# EAGLE design nrf5340 (EAGLE 9.7.0)
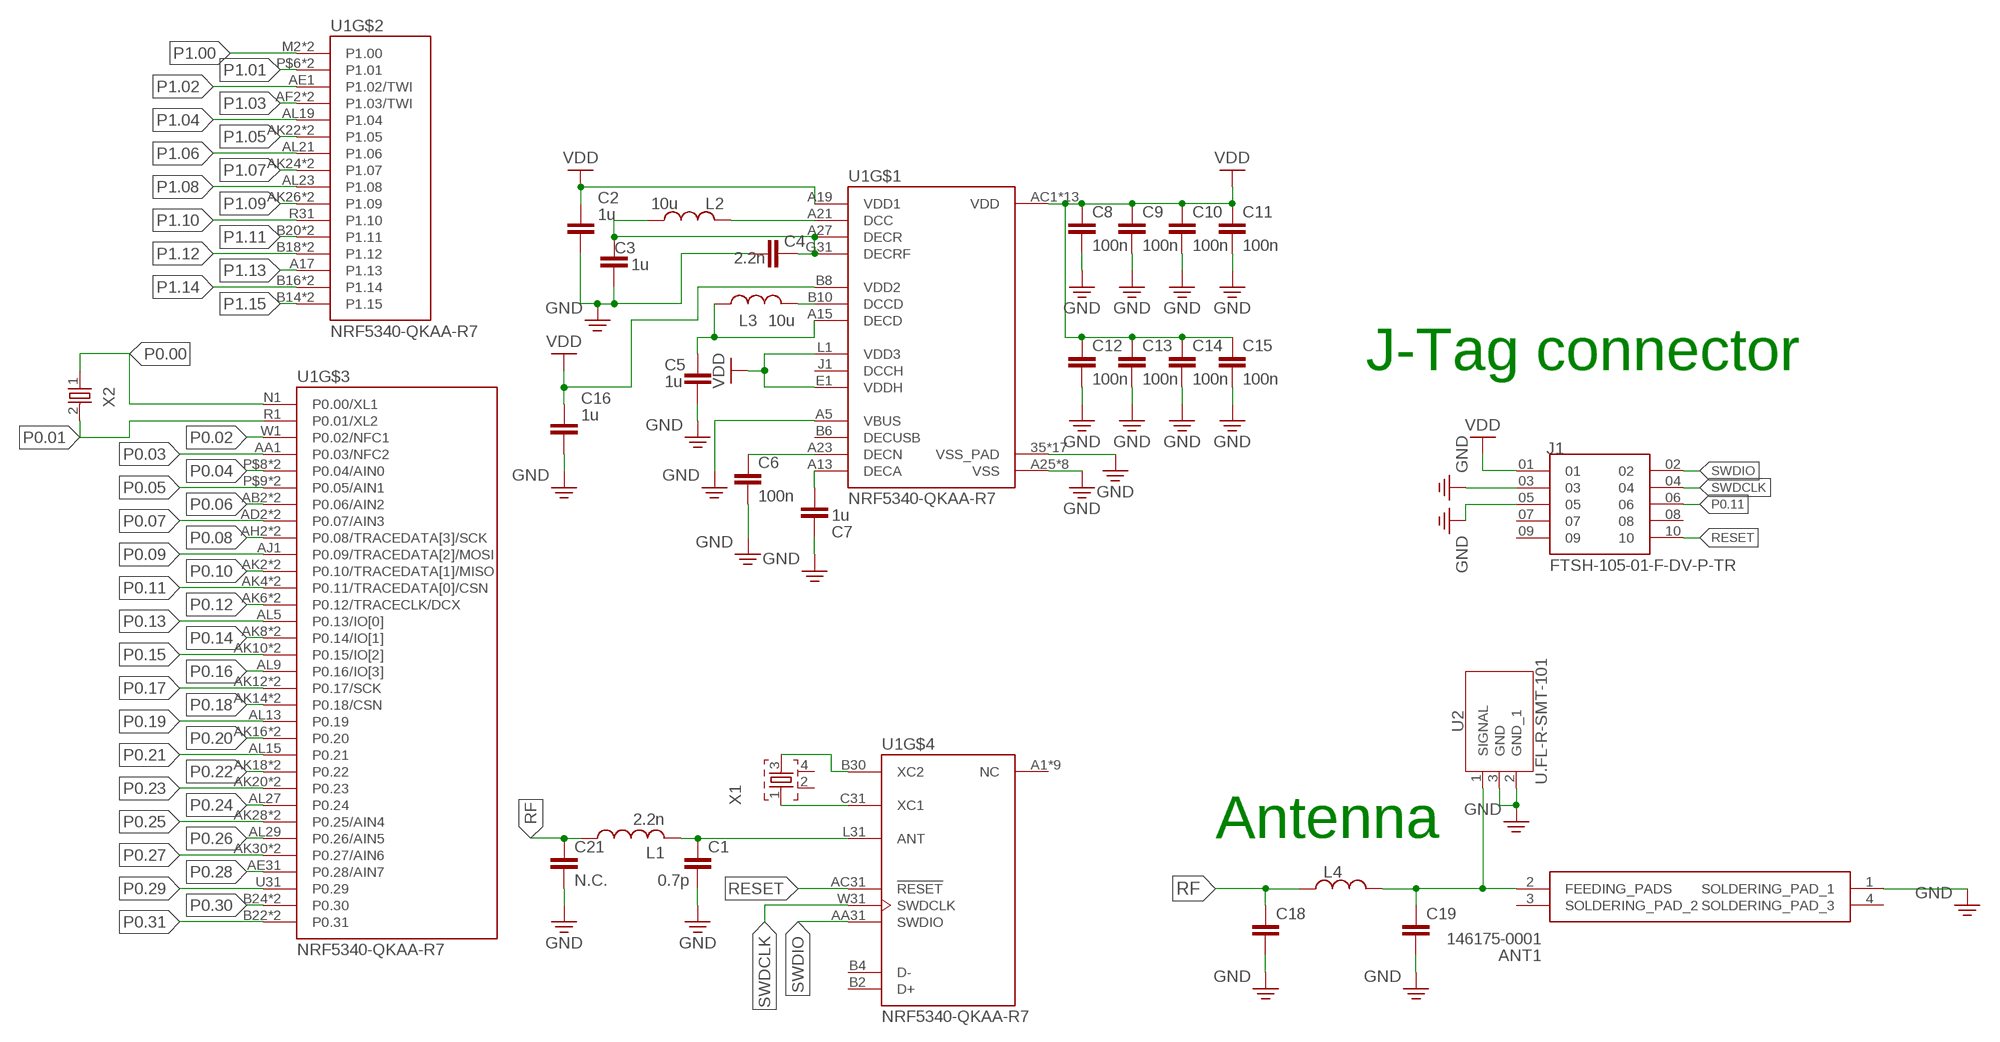
[diagram p0: schematic, sheet 1]

## Parts
ANT1  146175-0001  [1461750001]
C1  0.7p  CAPACITOR_0201_N  [RESC0201_N]
C2  1u  C_CHIP-0402(1005-METRIC)  [CAPC1005X60]
C3  1u  C_CHIP-0402(1005-METRIC)  [CAPC1005X60]
C4  2.2n  CAPACITOR_0201_N  [RESC0201_N]
C5  1u  C_CHIP-0402(1005-METRIC)  [CAPC1005X60]
C6  100n  CAPACITOR_0201_N  [RESC0201_N]
C7  1u  C_CHIP-0402(1005-METRIC)  [CAPC1005X60]
C8  100n  CAPACITOR_0201_N  [RESC0201_N]
C9  100n  CAPACITOR_0201_N  [RESC0201_N]
C10  100n  CAPACITOR_0201_N  [RESC0201_N]
C11  100n  CAPACITOR_0201_N  [RESC0201_N]
C12  100n  CAPACITOR_0201_N  [RESC0201_N]
C13  100n  CAPACITOR_0201_N  [RESC0201_N]
C14  100n  CAPACITOR_0201_N  [RESC0201_N]
C15  100n  CAPACITOR_0201_N  [RESC0201_N]
C16  1u  C_CHIP-0402(1005-METRIC)  [CAPC1005X60]
C18  CAPACITOR_0201_L  [RESC0201_L]
C19  CAPACITOR_0201_L  [RESC0201_L]
C21  N.C.  CAPACITOR_0201_N  [RESC0201_N]
J1  FTSH-105-01-F-DV-P-TR  [SAMTEC_FTSH-105-01-F-DV-P-TR]
L1  2.2n  INDUCTOR_0201_N  [RESC0201_N]
L2  10u  L_CHIP-0603(1608-METRIC)  [INDC1608X95N]
L3  10u  L_CHIP-0603(1608-METRIC)  [INDC1608X95N]
L4  L_CHIP-0402(1006-METRIC)  [INDC1006X60N]
U1  NRF5340-QKAA-R7  [XCVR_NRF5340-QKAA-R7]
U2  U.FL-R-SMT-101  [U.FL-R-SMT-1(XX)]
X1  XTAL_32MHZ  [BT-XTAL_2016_N]
X2  XTAL_32KHZ  [XTAL_3215_N]

## Nets
GND: ANT1.1(SOLDERING_PAD_1) C1.2 C2.2 C3.2 C4.2 C5.2 C6.2 C7.2 C8.2 C9.2 C10.2 C11.2 C12.2 C13.2 C14.2 C15.2 C16.2 C18.2 C19.2 C21.2 J1.03 J1.05 U1.35(VSS_PAD) U1.36(VSS_PAD) U1.37(VSS_PAD) U1.38(VSS_PAD) U1.39(VSS_PAD) U1.40(VSS_PAD) U1.41(VSS_PAD) U1.43(VSS_PAD) U1.44(VSS_PAD) U1.45(VSS_PAD) U1.46(VSS_PAD) U1.47(VSS_PAD) U1.48(VSS_PAD) U1.49(VSS_PAD) U1.50(VSS_PAD) U1.51(VSS_PAD) U1.104(VSS_PAD) U1.A5(VBUS) U1.A25(VSS) U1.B12(VSS) U1.B26(VSS) U1.G1(VSS) U1.H2(VSS) U1.J31(VSS) U1.P$3(VSS) U1.P$35(VSS) U2.2(GND_1) U2.3(GND)
N$1: C1.1 L1.2 U1.L31(ANT)
N$2: U1.C31(XC1) X1.1
N$3: U1.B30(XC2) X1.3
N$4: C6.1 U1.A23(DECN)
N$5: L2.2 U1.A21(DCC)
N$6: L3.2 U1.B10(DCCD)
N$7: C5.1 L3.1 U1.A15(DECD)
N$8: C3.1 C4.1 L2.1 U1.A27(DECR) U1.G31(DECRF)
N$9: C7.1 U1.A13(DECA)
N$11: ANT1.2(FEEDING_PADS) C19.1 L4.2 U2.1(SIGNAL)
P0.00: U1.N1(P0.00/XL1) X2.1
P0.01: U1.R1(P0.01/XL2) X2.2
P0.02: U1.W1(P0.02/NFC1)
P0.03: U1.AA1(P0.03/NFC2)
P0.04: U1.P$8(P0.04/AIN0) U1.V2(P0.04/AIN0)
P0.05: U1.P$9(P0.05/AIN1) U1.Y2(P0.05/AIN1)
P0.06: U1.AB2(P0.06/AIN2) U1.P$10(P0.06/AIN2)
P0.07: U1.AD2(P0.07/AIN3) U1.P$11(P0.07/AIN3)
P0.08: U1.AH2(P0.08/TRACEDATA[3]/SCK) U1.P$13(P0.08/TRACEDATA[3]/SCK)
P0.09: U1.AJ1(P0.09/TRACEDATA[2]/MOSI)
P0.10: U1.AK2(P0.10/TRACEDATA[1]/MISO) U1.P$14(P0.10/TRACEDATA[1]/MISO)
P0.11: J1.06 U1.AK4(P0.11/TRACEDATA[0]/CSN) U1.P$15(P0.11/TRACEDATA[0]/CSN)
P0.12: U1.AK6(P0.12/TRACECLK/DCX) U1.P$16(P0.12/TRACECLK/DCX)
P0.13: U1.AL5(P0.13/IO[0])
P0.14: U1.AK8(P0.14/IO[1]) U1.P$17(P0.14/IO[1])
P0.15: U1.AK10(P0.15/IO[2]) U1.P$18(P0.15/IO[2])
P0.16: U1.AL9(P0.16/IO[3])
P0.17: U1.AK12(P0.17/SCK) U1.P$19(P0.17/SCK)
P0.18: U1.AK14(P0.18/CSN) U1.P$20(P0.18/CSN)
P0.19: U1.AL13(P0.19)
P0.20: U1.AK16(P0.20) U1.P$21(P0.20)
P0.21: U1.AL15(P0.21)
P0.22: U1.AK18(P0.22) U1.P$22(P0.22)
P0.23: U1.AK20(P0.23) U1.P$23(P0.23)
P0.24: U1.AL27(P0.24)
P0.25: U1.AK28(P0.25/AIN4) U1.P$27(P0.25/AIN4)
P0.26: U1.AL29(P0.26/AIN5)
P0.27: U1.AK30(P0.27/AIN6) U1.P$28(P0.27/AIN6)
P0.28: U1.AE31(P0.28/AIN7)
P0.29: U1.U31(P0.29)
P0.30: U1.B24(P0.30) U1.P$34(P0.30)
P0.31: U1.B22(P0.31) U1.P$33(P0.31)
P1.00: U1.M2(P1.00) U1.P$5(P1.00)
P1.01: U1.P2(P1.01) U1.P$6(P1.01)
P1.02: U1.AE1(P1.02/TWI)
P1.03: U1.AF2(P1.03/TWI) U1.P$12(P1.03/TWI)
P1.04: U1.AL19(P1.04)
P1.05: U1.AK22(P1.05) U1.P$24(P1.05)
P1.06: U1.AL21(P1.06)
P1.07: U1.AK24(P1.07) U1.P$25(P1.07)
P1.08: U1.AL23(P1.08)
P1.09: U1.AK26(P1.09) U1.P$26(P1.09)
P1.10: U1.R31(P1.10)
P1.11: U1.B20(P1.11) U1.P$32(P1.11)
P1.12: U1.B18(P1.12) U1.P$31(P1.12)
P1.13: U1.A17(P1.13)
P1.14: U1.B16(P1.14) U1.P$30(P1.14)
P1.15: U1.B14(P1.15) U1.P$29(P1.15)
RESET: J1.10 U1.AC31(!RESET)
RF: C18.1 C21.1 L1.1 L4.1
SWDCLK: J1.04 U1.W31(SWDCLK)
SWDIO: J1.02 U1.AA31(SWDIO)
VDD: C2.1 C8.1 C9.1 C10.1 C11.1 C12.1 C13.1 C14.1 C15.1 C16.1 J1.01 U1.A19(VDD1) U1.AC1(VDD) U1.AG1(VDD) U1.AJ31(VDD) U1.AL3(VDD) U1.AL7(VDD) U1.AL11(VDD) U1.AL17(VDD) U1.AL25(VDD) U1.B8(VDD2) U1.B28(VDD) U1.C1(VDD) U1.E1(VDDH) U1.E31(VDD) U1.L1(VDD3) U1.N31(VDD) U1.U1(VDD)
Unconnected: ANT1.3(SOLDERING_PAD_2) ANT1.4(SOLDERING_PAD_3) J1.07 J1.08 J1.09 U1.A1(NC) U1.A31(NC) U1.AG31(NC) U1.AL1(NC) U1.AL31(NC) U1.B2(D+) U1.B4(D-) U1.D2(NC) U1.F2(NC) U1.K2(NC) U1.T2(NC) X1.2 X1.4

## Notes on the sheet
- J-Tag connector
- Antenna

## Power pins joined to a net without a drawn wire
DCCH: U1.J1(DCCH)
DECUSB: U1.B6(DECUSB)

## Library data of the parts
ANT1 = ChronosV5 v10:146175-0001: Antennas 2.4/5GHz SMTOnGround MID Chip Antenna Source: Datasheet <https://www.molex.com/pdm_docs/sd/1461750001_sd.pdf>; DESCRIPTION: Antennas 2.4/5GHz SMTOnGround MID Chip Antenna; HEIGHT: 4.1mm; MANUFACTURER_NAME: Molex; MANUFACTURER_PART_NUMBER: 146175-0001; MOUSER_PART_NUMBER: 538-146175-0001; MOUSER_PRICE-STOCK: https://www.mouser.co.uk/ProductDetail/Molex/146175-0001?qs=XFe3dyCRgQjkov2fyUw2sg%3D%3D
C1 C4 C6 C8-C15 C18 C19 C21 = ChronosV5 v10:CAPACITOR: Generic chip capacitor
C2 C3 C5 C7 C16 = ChronosV5 v10:C: Capacitor - Generic; CATEGORY: Capacitor
J1 = FTSH-105-01-F-DV-P-TR:FTSH-105-01-F-DV-P-TR; MANUFACTURER: Samtec; PARTREV: R; STANDARD: Manufacturer Recommendations
L1 = ChronosV5 v10:INDUCTOR: Generic chip inductor
L2-L4 = Inductor:L: Inductor Fixed - Generic; CATEGORY: Inductor; SUB-CATEGORY: Fixed
U1 = NRF5340-aQFN:NRF5340-QKAA-R7; MANUFACTURER: Nordic Semiconductor; MAXIMUM_PACKAGE_HEIGHT: 0.85mm; PARTREV: 1.0; STANDARD: Manufacturer Recommendations
U2 = ChronosV5 v10:U.FL-R-SMT-1: U.FL (UMCC) Connector Receptacle, Male Pin 50Ohm Surface Mount Solder Datasheet <https://media.digikey.com/pdf/Data%20Sheets/Hirose%20PDFs/UFL%20Series.pdf> Drawing <https://www.hirose.com/product/document?clcode=CL0331-0472-2-10&productname=U.FL-R-SMT-1(10)&series=U.FL&documenttype=2DDrawing&lang=en&documentid=0000940684>; CATEGORY: RF Connectors / Coaxial Connectors; DESCRIPTION: Ultra Small Surface Mount Coaxial Connectors; MANUFACTURER: Hirose Electric Co Ltd; MPN: U.FL-R-SMT-1(01); OPERATING_TEMPERATURE: -40˚C to +90˚C; PART_STATUS: Active; PITCH: -; ROHS_COMPLIANCE: RoHS Compliant; SERIES: U.FL; SUBCATEGORY: RF Interconnects; TYPE: Receptacle, Male Pin,Surface Mount
X1 = Nordic_nRF:XTAL_32MHZ
X2 = Nordic_nRF:XTAL_32KHZ

## Board
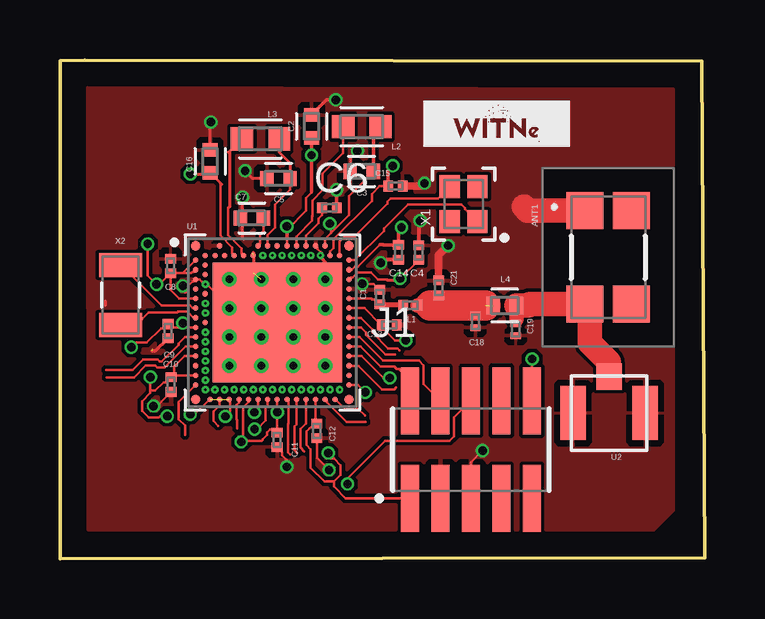
[diagram p1: board, top side]
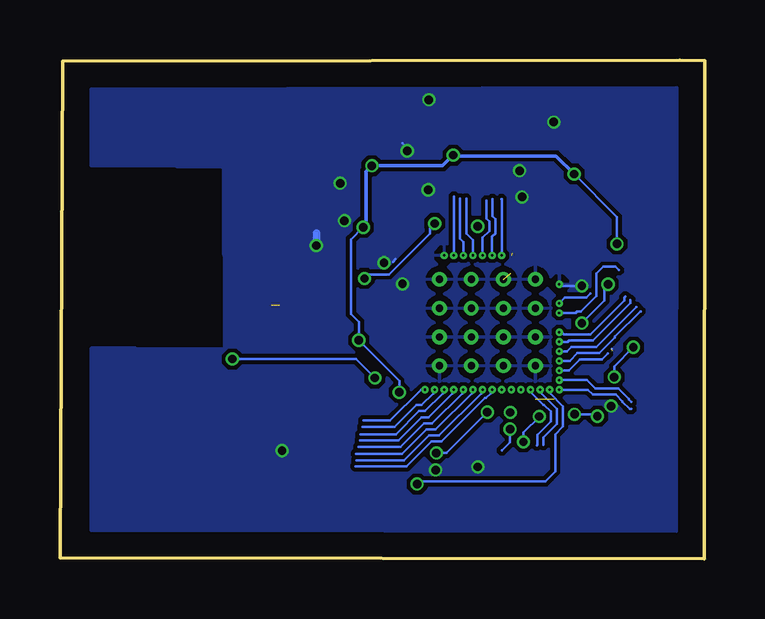
[diagram p2: board, bottom side, seen from below]

Size 26.88 x 20.81 mm. Coordinates in mm from the lower left corner, seen from the top.
Outline: 1.04,20.81 26.76,20.75 26.88,0.04 0.02,0 0,20.78 1.04,20.81
Copper layers (1*16): Top / Bottom
Stack-up 2 Layer Stack: Top SilkScreen Epoxy Ink / Top SolderMask SR:Green 0.0254mm Dk 4.3 / Top Surface Finish Lead-Free 0.02mm / Top CuFoil:007 0.035mm / Dielectric-1 Core:084 1.067mm / Bottom CuFoil:007 0.035mm / Bottom Surface Finish Lead-Free 0.02mm / Bottom SolderMask SR:Green 0.0254mm Dk 4.3 / Bottom SilkScreen Epoxy Ink
Design rules: minimum copper width 0.005mm, minimum drill size 0.35mm, copper clearance wire_polygon to wire_polygon 6mil, copper clearance wire_polygon to pad_smd 6mil, copper clearance wire_polygon to via 6mil, copper clearance pad_smd to pad_smd 6mil, copper clearance pad_smd to via 6mil, copper clearance via to via 6mil, copper clearance smd to pad (same net) 6mil, copper clearance smd to via (same net) 6mil, copper clearance smd to smd (same net) 6mil, dimension clearance 40mil, via restrict clearance 0mil, restrict clearance 0mil, drill distance 6mil, keepout clearance 0mil
RestrictTop: area 20.1,12.5 to 23.7,16.3; area 22,12.6 to 25.6,16.4; area 20.2,8.9 to 23.8,12.7; area 22,8.8 to 25.6,12.6
RestrictBottom: area 22.1,12.5 to 25.7,16.3; area 20.1,12.5 to 23.7,16.3; area 22,8.9 to 25.6,12.7; area 20.1,8.8 to 23.7,12.6

### Footprints (pad centres in the part's own frame; a part is rotated, then mirrored left to right if it is on the bottom)
1461750001 = smd 1.54 x 1.54: 1 -1.95,-0.97; 2 1.95,-0.97; 3 1.95,0.97; 4 -1.95,0.97
RESC0201_N = smd 0.4 x 0.45: 1 -0.305,0; 2 0.305,0
CAPC1005X60 = smd 0.56 x 0.629: 1 -0.485,0; 2 0.485,0
RESC0201_L = smd 0.28 x 0.43: 1 -0.255,0; 2 0.255,0
SAMTEC_FTSH-105-01-F-DV-P-TR = smd 0.74 x 2.79: 01 -2.54,-2.035; 02 -2.54,2.035; 03 -1.27,-2.035; 04 -1.27,2.035; 05 0,-2.035; 06 0,2.035; 07 1.27,-2.035; 08 1.27,2.035; 09 2.54,-2.035; 10 2.54,2.035
INDC1608X95N = smd 0.9 x 0.97: 1 -0.785,0 | smd 0.933 x 0.97: 2 0.769,0
INDC1006X60N = smd 0.56 x 0.729: 1 -0.485,0; 2 0.485,0
XCVR_NRF5340-QKAA-R7 = drill 0.305 pad 0.61: 35 -1.8,-1.8; 36 -0.467,-1.8; 37 0.867,-1.8; 38 2.2,-1.8; 39 -1.8,-0.6; 40 -0.467,-0.6; 41 0.867,-0.6; 43 2.2,-0.6; 44 -1.8,0.6; 45 -0.467,0.6; 46 0.867,0.6; 47 2.2,0.6; 48 -1.8,1.8; 49 -0.467,1.8; 50 0.867,1.8; 51 2.2,1.8 | smd 5.4 x 5: 104 0.2,0 | smd 0.4 x 0.4: A1 -3.2,3.2; A31 3.2,3.2; AL1 -3.2,-3.2; AL31 3.2,-3.2 | smd 0.225 x 0.225: A5 -2.2,3.2; A13 -0.6,3.2; A15 -0.2,3.2; A17 0.2,3.2; A19 0.6,3.2; A21 1,3.2; A23 1.4,3.2; A25 1.8,3.2; A27 2.2,3.2; AA1 -3.2,-1; AA31 3.2,-1; AB2 -2.8,-1.2; AC1 -3.2,-1.4; AC31 3.2,-1.4; AD2 -2.8,-1.6; AE1 -3.2,-1.8; AE31 3.2,-1.8; AF2 -2.8,-2; AG1 -3.2,-2.2; AG31 3.2,-2.2; AH2 -2.8,-2.4; AJ1 -3.2,-2.6; AJ31 3.2,-2.6; AK2 -2.8,-2.8; AK4 -2.4,-2.8; AK6 -2,-2.8; AK8 -1.6,-2.8; AK10 -1.2,-2.8; AK12 -0.8,-2.8; AK14 -0.4,-2.8; AK16 0,-2.8; AK18 0.4,-2.8; AK20 0.8,-2.8; AK22 1.2,-2.8; AK24 1.6,-2.8; AK26 2,-2.8; AK28 2.4,-2.8; AK30 2.8,-2.8; AL3 -2.6,-3.2; AL5 -2.2,-3.2; AL7 -1.8,-3.2; AL9 -1.4,-3.2; AL11 -1,-3.2; AL13 -0.6,-3.2; AL15 -0.2,-3.2; AL17 0.2,-3.2; AL19 0.6,-3.2; AL21 1,-3.2; AL23 1.4,-3.2; AL25 1.8,-3.2; AL27 2.2,-3.2; AL29 2.6,-3.2; B2 -2.8,2.8; B4 -2.4,2.8; B6 -2,2.8; B8 -1.6,2.8; B10 -1.2,2.8; B12 -0.8,2.8; B14 -0.4,2.8; B16 0,2.8; B18 0.4,2.8; B20 0.8,2.8; B22 1.2,2.8; B24 1.6,2.8; B26 2,2.8; B28 2.4,2.8; B30 2.8,2.8; C1 -3.2,2.6; C31 3.2,2.6; D2 -2.8,2.4; E1 -3.2,2.2; E31 3.2,2.2; F2 -2.8,2; G1 -3.2,1.8; G31 3.2,1.8; H2 -2.8,1.6; J1 -3.2,1.4; J31 3.2,1.4; K2 -2.8,1.2; L1 -3.2,1; L31 3.2,1; M2 -2.8,0.8; N1 -3.2,0.6; N31 3.2,0.6; P2 -2.8,0.4; R1 -3.2,0.2; R31 3.2,0.2; T2 -2.8,0; U1 -3.2,-0.2; U31 3.2,-0.2; V2 -2.8,-0.4; W1 -3.2,-0.6; W31 3.2,-0.6; Y2 -2.8,-0.8 | drill 0.1 pad 0.23: P$3 -2.8,1.6; P$5 -2.8,0.8; P$6 -2.8,0.4; P$8 -2.8,-0.4; P$9 -2.8,-0.8; P$10 -2.8,-1.2; P$11 -2.8,-1.6; P$12 -2.8,-2; P$13 -2.8,-2.4; P$14 -2.8,-2.8; P$15 -2.4,-2.8; P$16 -2,-2.8; P$17 -1.6,-2.8; P$18 -1.2,-2.8; P$19 -0.8,-2.8; P$20 -0.4,-2.8; P$21 0,-2.8; P$22 0.4,-2.8; P$23 0.8,-2.8; P$24 1.2,-2.8; P$25 1.6,-2.8; P$26 2,-2.8; P$27 2.4,-2.8; P$28 2.8,-2.8; P$29 -0.4,2.8; P$30 0,2.8; P$31 0.4,2.8; P$32 0.8,2.8; P$33 1.2,2.8; P$34 1.6,2.8; P$35 2,2.8
U.FL-R-SMT-1(XX) = smd 1.05 x 1.1: 1 0,1.525 | smd 1.05 x 2.25: 2 -1.5,0; 3 1.5,0
BT-XTAL_2016_N = smd 0.95 x 0.85: 1 -0.725,-0.575; 2 0.725,-0.575; 3 0.725,0.575; 4 -0.725,0.575
XTAL_3215_N = smd 1 x 1.8: 1 -1.25,0; 2 1.25,0

### Placement (x,y rotation side)
ANT1  22.86,12.58 270 top
C1  13.33,10.92 90 top
C2  10.49,18.04 90 top
C3  12.58,16.16 180 top
C4  14.96,12.78 90 top
C5  9.11,15.87 180 top
C6  11.23,14.64 0 top
C7  8,14.22 180 top
C8  4.61,12.22 90 top
C9  4.51,9.51 270 top
C10  4.63,7.27 270 top
C11  9.05,4.97 270 top
C12  10.71,5.34 270 top
C13  13.73,9.76 0 top
C14  14.12,12.79 270 top
C15  13.99,15.55 0 top
C16  6.26,16.58 90 top
C18  17.32,9.9 270 top
C19  19,9.57 270 top
C21  15.79,11.31 90 top
J1  17.13,4.56 0 top
L1  14.61,10.58 180 top
L2  12.58,18.03 180 top
L3  8.36,17.52 180 top
L4  18.54,10.57 0 top
U1  8.86,9.86 0 top
U2  22.89,6.08 0 top
X1  16.83,14.8 90 top
X2  2.53,11.01 270 top

### Tracks (layer width: path | path; a pad name or v marks a point on that pad's centre or on a via)
GND  (via drill 0.35, 0.35 pad 0.5)  (3 unrouted)
  Top 0.076: 8.07,12.73 8.09,12.7
  Top 0.102: 13.33,12.18 13.33,12.19 13.37,12.22 v13.37,12.35 | v12.4,17.01 12.11,16.72 12.11,16.17 C3.2 | 8.16,12.27 8.16,12 8.08,11.92 | U1.104 7.71,9.86 6.19,11.38 6.14,11.38 U1.P$3 5.98,11.54 5.93,11.54 5.81,11.66 U1.G1 5.58,11.58 5.53,11.58 5.21,11.26 5.21,11.14 | U1.A25 10.74,12.98 10.74,12.93 10.92,12.76 10.92,12.6 | C1.2 13.08,11.47 v12.6,11.47 | C10.2 4.04,6.38 v3.9,6.38 | J1.05 17.13,4.03 v17.62,4.52 | C12.2 10.71,4.22 v11.22,3.71 | v9.46,3.84 9.46,4.14 9.27,4.33 9.27,4.45 C11.2
  Top 0.127: C6.2 v11.54,15.38 v11.53,15.39 | C5.2 8.04,15.87 v7.72,16.19 | C16.2 6.26,18.19 v6.29,18.22 | 8.03,12.76 8.07,12.73 | 7.66,13.33 7.61,13.37 v7.61,15.1 | 8.06,12.8 8.08,12.77 8.08,12.71 8.09,12.7 8.09,12.34 8.16,12.27
  Top 0.15: C4.2 14.96,14.05 v15.02,14.11
  Top 0.152: C2.2 11.11,19.15 v11.5,19.15 | C14.2 13.63,12.48 13.33,12.19 | 5.22,11.14 5.21,11.14 5.12,11.23 v5.12,11.39 | C9.2 3.97,8.67 3.85,8.67 | U1.P$35 10.92,12.6 10.92,12.52 11.06,12.38 U1.51 | 1.88,10.6 1.88,10.73
  Top 0.305: C21.2 15.79,12.67 v16.19,13.07 | C15.2 15.08,15.55 v15.2,15.67
  Top 1.016: ANT1.1 19.5,14.53 19.34,14.69
  Bottom 0.102: v12.4,17.01 12.4,17.14 12.6,17.34 | U1.P$3 5.99,11.39 v5.12,11.39 | 3.86,8.75 | 13,12.38 12.88,12.51 | 12.53,11.53 12.59,11.47 v12.6,11.47 | v9.46,3.84
  Bottom 0.305: 16.19,13.6 v16.19,13.07
  pour Top: -2.85,21.26 -2.85,1.15 24.78,1.15 25.64,2.01 25.64,20.85 25.23,21.26
  pour Bottom: -3.11,21.35 25.65,21.35 25.65,0.07 -3.11,0.07
N$1
  Top 0.102: U1.L31 12.98,10.86 13.02,10.82 13.13,10.82 C1.1
  Top 0.127: C1.1
  Top 0.15: 13.24,10.7 C1.1
  Top 0.203: C1.1 14.27,10.62 L1.2
N$2
  Top 0.102: X1.1 16.88,14.6 16.88,14.63 16.74,14.78 14.51,14.78 13.51,13.78 13.51,13.68 12.29,12.46 U1.C31
N$3
  Top 0.102: X1.3 15.76,15.03 13.79,15.03 13.67,14.91 13.67,14.82 12.31,13.46 11.89,13.46 11.66,13.23 11.66,12.89 U1.B30
N$4
  Top 0.102: U1.A23 10.26,13.48 10.77,14 10.77,14.19 10.92,14.34 C6.1
  Top 0.127: 10.92,14.51 C6.1
N$5
  Top 0.102: L2.2 11.81,16.93 10.95,16.06 10.95,15.38 10.52,14.95 10.52,14.29 10.52,14.1 9.86,13.45 U1.A21
N$6
  Top 0.102: U1.B10 7.58,12.74 7.58,12.95 7.02,13.51 7.02,14.62
  Top 0.127: 7.02,16.95 7.09,17.01 | 7.09,17.01 L3.2 | 7.02,14.62 7.09,14.69 7.09,17.01
N$7
  Top 0.102: U1.A15 8.66,13.51 8.97,13.82 8.97,14.78 9.59,15.41 C5.1
  Top 0.127: L3.1 9.14,16.97 9.59,16.52 C5.1
N$8  (via drill 0.35, 0.35 pad 0.5)
  Top 0.102: C4.1 v14.18,11.7 14.11,11.63 | 13.07,16.15 12.05,15.12 12.05,14.34 11.31,13.59 | U1.A27 11.06,13.35 11.31,13.59 | 13.64,11.64 13.62,11.66 13.25,11.66 12.96,11.95 12.4,11.95 12.2,11.74 12.14,11.74 U1.G31 | 11.31,13.59 11.29,13.61 11.29,13.95 v11.25,13.99
  Top 0.127: 13.64,11.64 13.66,11.63 14.11,11.63
  Top 0.152: L2.1 13.07,17.74 13.07,16.15 C3.1
  Bottom 0.102: v14.18,11.7 14.01,11.87 13.16,11.87 11.45,13.58 11.45,13.79 v11.25,13.99
N$9
  Top 0.102: C7.1 8.48,13.7 8.34,13.56 8.34,13.14 U1.A13
  Top 0.152: 8.35,14.09 C7.1
N$11
  Top 0.102: L4.2 19.03,9.85 C19.1
  Top 0.61: L4.2 19.03,9.99 19.03,9.98
  Top 1.016: L4.2 19.53,10.57 19.59,10.63 ANT1.2 22.1,10.63 22.1,9.01 22.89,8.22 U2.1
P0.00
  Top 0.102: X2.1 2.55,12.26 4.24,10.57 5.42,10.57 5.53,10.46 U1.N1
P0.01
  Top 0.102: 2.22,10.07 X2.2 3.19,9.76 3.7,10.27 4.88,10.27 4.92,10.32 5.32,10.32 5.57,10.06 U1.R1
P0.02
  Top 0.102: U1.W1 5.22,9.26 4.94,8.98 4.94,8.92 4.25,8.23 4.16,8.23 4.07,8.32 3.47,8.32 3.03,7.88 1.93,7.88
P0.03
  Top 0.102: U1.AA1 5.24,8.86 4.36,7.98 4.05,7.98 3.97,8.06 3.57,8.06 3.09,7.58 1.94,7.58
P0.04
  Bottom 0.102: U1.V2 6.01,9.41 5.91,9.41 5.86,9.36 4.77,9.36 3.34,10.79 3.34,10.91 3.3,10.95
P0.05
  Bottom 0.102: 3.09,10.8 3.09,10.68 4.67,9.1 5.66,9.1 5.71,9.06 U1.P$9
P0.06
  Bottom 0.102: U1.AB2 5.75,8.66 5.56,8.85 4.52,8.85 2.86,10.52
P0.07
  Bottom 0.102: 2.67,10.33 2.68,10.33 3.74,9.27 3.74,9.23 4.39,8.58 5.3,8.58 5.63,8.26 U1.AD2
P0.08
  Bottom 0.102: U1.P$13 4.9,7.46 4.55,7.11 3.6,7.11 3.17,6.68 3.17,6.65 3.06,6.54
P0.09
  Top 0.102: 5.21,5.17 5.21,5.56 4.95,5.82 4.95,6.55 U1.AJ1
P0.10
  Bottom 0.102: U1.AK2 4.86,7.06 4.66,6.86 3.7,6.86 3.42,6.58 3.42,6.55 3.13,6.25 3.05,6.25
P0.11  (via drill 0.35)
  Top 0.102: J1.06 16.43,5.9 16.43,5.12 16.25,4.93 13.55,4.93 11.99,3.37 v11.99,3.13
  Bottom 0.102: U1.AK4 6.46,6.92 5.91,6.37 5.91,5.52 6.23,5.2 6.23,3.65 6.65,3.23 11.89,3.23 v11.99,3.13
P0.12
  Bottom 0.102: U1.AK6 6.86,6.96 6.16,6.26 6.16,5.63 6.73,5.07 6.73,4.76
P0.13
  Top 0.102: 6.59,5.55 6.4,5.75 6.4,6.14 6.66,6.4 U1.AL5
P0.14
  Bottom 0.102: 7,4.74 6.98,4.76 6.98,5.17 6.42,5.73 6.42,6.14 6.7,6.42 6.72,6.42 7.26,6.96 U1.P$17
P0.16
  Top 0.102: U1.AL9 7.46,6.52 7.37,6.43 7.37,5.81 7.38,5.8 7.38,5.44
P0.19  (via drill 0.35)
  Top 0.102: U1.AL13 8.26,6.28 8.1,6.13 v8.1,6.11
P0.20
  Bottom 0.102: U1.AK16 8.91,7.01 8.91,6.91 9.11,6.71 9.15,6.71 10.96,4.9 11.39,4.9 12.43,3.86 14.56,3.86
P0.21  (via drill 0.35)
  Top 0.102: v8.11,5.41 8.22,5.41 8.58,5.77 8.58,6.32 8.66,6.4 U1.AL15
  Bottom 0.102: v8.11,5.41 8.11,4.87 8.45,4.53
P0.22
  Bottom 0.102: U1.P$22 9.31,7.01 9.31,6.91 11.07,5.15 11.49,5.15 12.53,4.11 14.52,4.11
P0.23
  Bottom 0.102: U1.P$23 9.71,7.01 9.71,6.91 11.21,5.41 11.6,5.41 12.61,4.39 14.54,4.39
P0.24
  Top 0.102: U1.AL27 11.14,6.58 11.14,6.53 11.95,5.73 12.73,5.73
P0.25
  Bottom 0.102: U1.P$27 11.31,7.01 11.31,6.91 11.8,6.42 12.02,6.42 12.94,5.5 14.27,5.5
P0.26
  Top 0.102: U1.AL29 11.49,6.66 11.89,6.26 12.43,6.26 12.71,5.98
P0.27
  Bottom 0.102: U1.P$28 11.83,7.06 13.11,5.78 14.23,5.78
P0.28
  Top 0.102: U1.AE31 12.44,8.06 13.43,7.07 13.95,7.07 14.02,7.14
P0.29
  Top 0.102: U1.U31 12.56,9.66 12.77,9.45 12.77,9.35 13.58,8.53 13.97,8.53
P0.30
  Bottom 0.102: U1.P$34 10.46,15.12
P0.31
  Bottom 0.102: U1.B22 10.06,13.22 10.2,13.36 10.2,15.03
P1.00
  Bottom 0.102: U1.P$5 5.82,10.9 4.93,10.9 4.76,11.07
P1.01
  Bottom 0.102: 3.57,12.04 3.72,12.19 4.22,12.19 4.51,11.9 4.51,10.97 5.15,10.32 5.32,10.32 5.38,10.26 U1.P$6
P1.03
  Bottom 0.102: U1.AF2 5.67,7.86 5.2,8.33 4.28,8.33 4.04,8.57
P1.04
  Top 0.102: U1.AL19 9.54,6.58 9.54,5.65 9.52,5.64 9.52,4.44 9.58,4.37
P1.05
  Bottom 0.102: U1.P$24 10.11,7.01 10.11,6.91 11.36,5.66 11.7,5.66 12.68,4.68 14.43,4.68
P1.06
  Top 0.102: U1.AL21 9.86,5.62 9.77,5.53 9.77,4.54 9.89,4.42 | 9.89,4.42
P1.07
  Bottom 0.102: U1.AK24 10.51,7.01 10.51,6.91 11.51,5.91 11.81,5.91 12.77,4.95 14.38,4.95
P1.08
  Top 0.102: U1.AL23 10.26,5.66 10.03,5.42 10.03,4.65 10.18,4.5 | 10.18,4.5
P1.09
  Bottom 0.102: U1.P$26 10.91,7.01 10.91,6.91 11.65,6.17 11.91,6.17 12.88,5.2 14.35,5.2
P1.10
  Top 0.102: U1.R31 12.54,10.06 13.02,9.58 13.02,9.45 13.68,8.79 14.08,8.79 14.16,8.7
P1.11
  Bottom 0.102: U1.B20 9.66,13.3 9.94,13.58 9.94,15.03
P1.12
  Bottom 0.102: U1.P$31 9.26,13.4 8.98,13.67 8.98,14.07 9.1,14.19 9.1,14.95
P1.14
  Bottom 0.102: U1.P$30 8.86,13.44 8.73,13.57 8.73,14.17 8.85,14.29 8.85,15.01
P1.15
  Bottom 0.102: U1.P$29 8.46,15 8.47,15.01
RESET  (via drill 0.35)
  Top 0.102: U1.AC31 12.58,8.46 13.49,7.55 v13.75,7.55 | v19.69,8.34 19.67,8.32 J1.10
  Bottom 0.102: v13.75,7.55 14.54,8.34 v19.69,8.34
RF  (1 unrouted)
  Top 0.102: C18.1 17.73,10.57 L4.1
  Top 0.305: L1.1 15.36,10.58 C21.1
  Top 0.61: L1.1 15.45,10.58
  Top 1.27: 15.45,10.58 17.73,10.58
SWDCLK
  Top 0.102: J1.04 15.16,7.29 15.16,8.08 14.96,8.28 13.47,8.28 12.49,9.26 U1.W31
SWDIO
  Top 0.102: 14.41,7.93 14.12,7.93 | 14.12,7.93 14.04,7.93 13.95,8.03 13.37,8.03 12.54,8.86 U1.AA31 | 14.12,7.93 14.59,7.46 J1.02
VDD  (via drill 0.35, 0.35 pad 0.5)  (1 unrouted)
  Top 0.102: 10.49,15.31 10.49,15.27 10.27,15.05 10.27,14.53 9.48,13.74 9.48,13.85 v9.46,13.87 | 9.46,13.42 U1.A19 | U1.B28 11.26,12.81 11.4,12.96 11.4,13.33 13,14.93 13,15.22 13.33,15.55 C15.1 | 4.31,9.62 C9.1 | 5.23,9.66 4.7,9.66 4.65,9.62 4.31,9.62 | 5.23,9.66 U1.U1 | C10.1 4.72,7.66 U1.AG1 | U1.E1 5.58,11.98 5.53,11.98 5.47,11.91 5.11,11.91 | 5.11,11.91 U1.C1 | C8.1 5.11,11.91 | C10.1 4.43,7.37 4.32,7.37 3.97,7.02 3.77,7.02 | C8.1 4.61,11.22 4.97,10.86 U1.L1 | U1.AC1 5.2,8.46 4.76,8.02 4.76,7.7 C10.1 | 9.06,6.14 U1.AL17 | C12.1 10.66,5.7 | 10.66,5.7 U1.AL25 | U1.AL3 6.23,6.66 5.6,6.03 v5.43,6.03 | C8.1 4.15,11.46 v4.03,11.46 3.66,11.83 v3.66,13.14 | 5.23,9.66 5.12,9.77 v5.12,9.84 | 4.31,9.62 4.21,9.62 3.62,9.03 3.17,9.03 v2.97,8.83 | 13.36,13.12 13.34,13.12 12.43,12.2 12.3,12.2 12.15,12.06 U1.E31 | U1.N31 12.69,10.46 13.39,9.76 | v12.73,6.95 12.42,7.26 U1.AJ31 | U1.B8 7.18,12.74 7.18,12.99 6.69,13.48 6.69,15.67 | U1.AL7 7.1,6.62 7.1,6.17 v6.89,5.96 v6.89,5.95 | v7.56,4.89 7.61,4.93 | 7.61,4.93 7.63,4.96 7.63,5.91 7.63,5.92 7.63,6.33 7.86,6.56 U1.AL11 | 7.61,4.93 8.41,4.93 8.45,4.97 8.45,4.98 8.64,5.17 8.64,5.28 8.76,5.39 8.93,5.39 C11.1 9.06,6.14 | 10.66,5.7 10.4,5.44 10.28,5.32 10.28,4.75 10.46,4.58 10.46,3.8 11.02,3.23 11.42,3.23 | 9.06,6.14 v9.06,6.12 | 3.77,7.02 3.77,6.92 3.42,6.58 3.42,6.18 3.7,5.9 4.11,5.9 4.17,5.95 v4.47,5.95 | v3.77,7.59 3.77,7.02 | C13.1 13.63,9.55 13.63,9.45 13.96,9.12 v14.42,9.12 | v11.19,4.42 11.13,4.42 11,4.29 11.1,4.19 11.42,4.19 11.7,3.91 11.7,3.51 11.42,3.23 | J1.01 11.92,2.53 11.42,3.03 11.42,3.23
  Top 0.127: 6.74,15.62 6.69,15.67 C16.1 6.2,16.03 5.44,16.03 v5.44,16.05 | 13.47,13.11 13.39,13.11 | C13.1 13.39,9.76
  Top 0.15: C14.1 13.48,13.09 13.47,13.11 13.46,13.12
  Top 0.152: C2.1 v10.49,16.84 10.49,15.31 | v13.87,16.4 13.68,16.21 C15.1 | 13.41,9.76 C13.1 | 13.46,13.12 13.36,13.12 13.35,13.11 | v14.24,13.83 14.12,13.72 C14.1 | 9.46,13.42 9.46,13.72 9.48,13.74
  Bottom 0.102: v4.03,11.46 4.18,11.31 4.18,10.78 v5.12,9.84 | v2.97,8.83 3.77,8.03 v3.77,7.59 | v14.24,13.83 14.74,13.33 14.74,10.22 14.41,9.89 14.41,9.11 | 14.41,9.11 12.73,7.43 v12.73,6.95 | v7.56,4.89 7.56,5.27 6.89,5.93 v6.89,5.95 | v4.47,5.95 4.55,6.03 v5.43,6.03 | v3.66,13.14 3.66,14.27 v5.44,16.05 | 14.41,9.11 v14.41,9.11 v14.42,9.12 | v9.06,6.12 10.77,4.42 v11.19,4.42
  Bottom 0.127: 10.48,16.81 10.49,16.82 v10.49,16.84
  Bottom 0.152: v5.44,16.05 6.2,16.81 10.46,16.81 v10.49,16.84 10.93,16.4 v13.87,16.4 14.11,16.16 14.11,13.96 v14.24,13.83

### Text on the board
SilkscreenTop: C:/Users/bscov/OneDrive/Pictures/WITNe_LOGOv4.bmp